# EasyEDA schematic 1-Schematic_Robot_Dog_ESP32_Control_PCB[1].json
TITLE: Sheet_1; REV: 1.0; Date: 2026-08-09; Sheet: 1/1; Drawn By: reemmelfi0; Company: Your Company
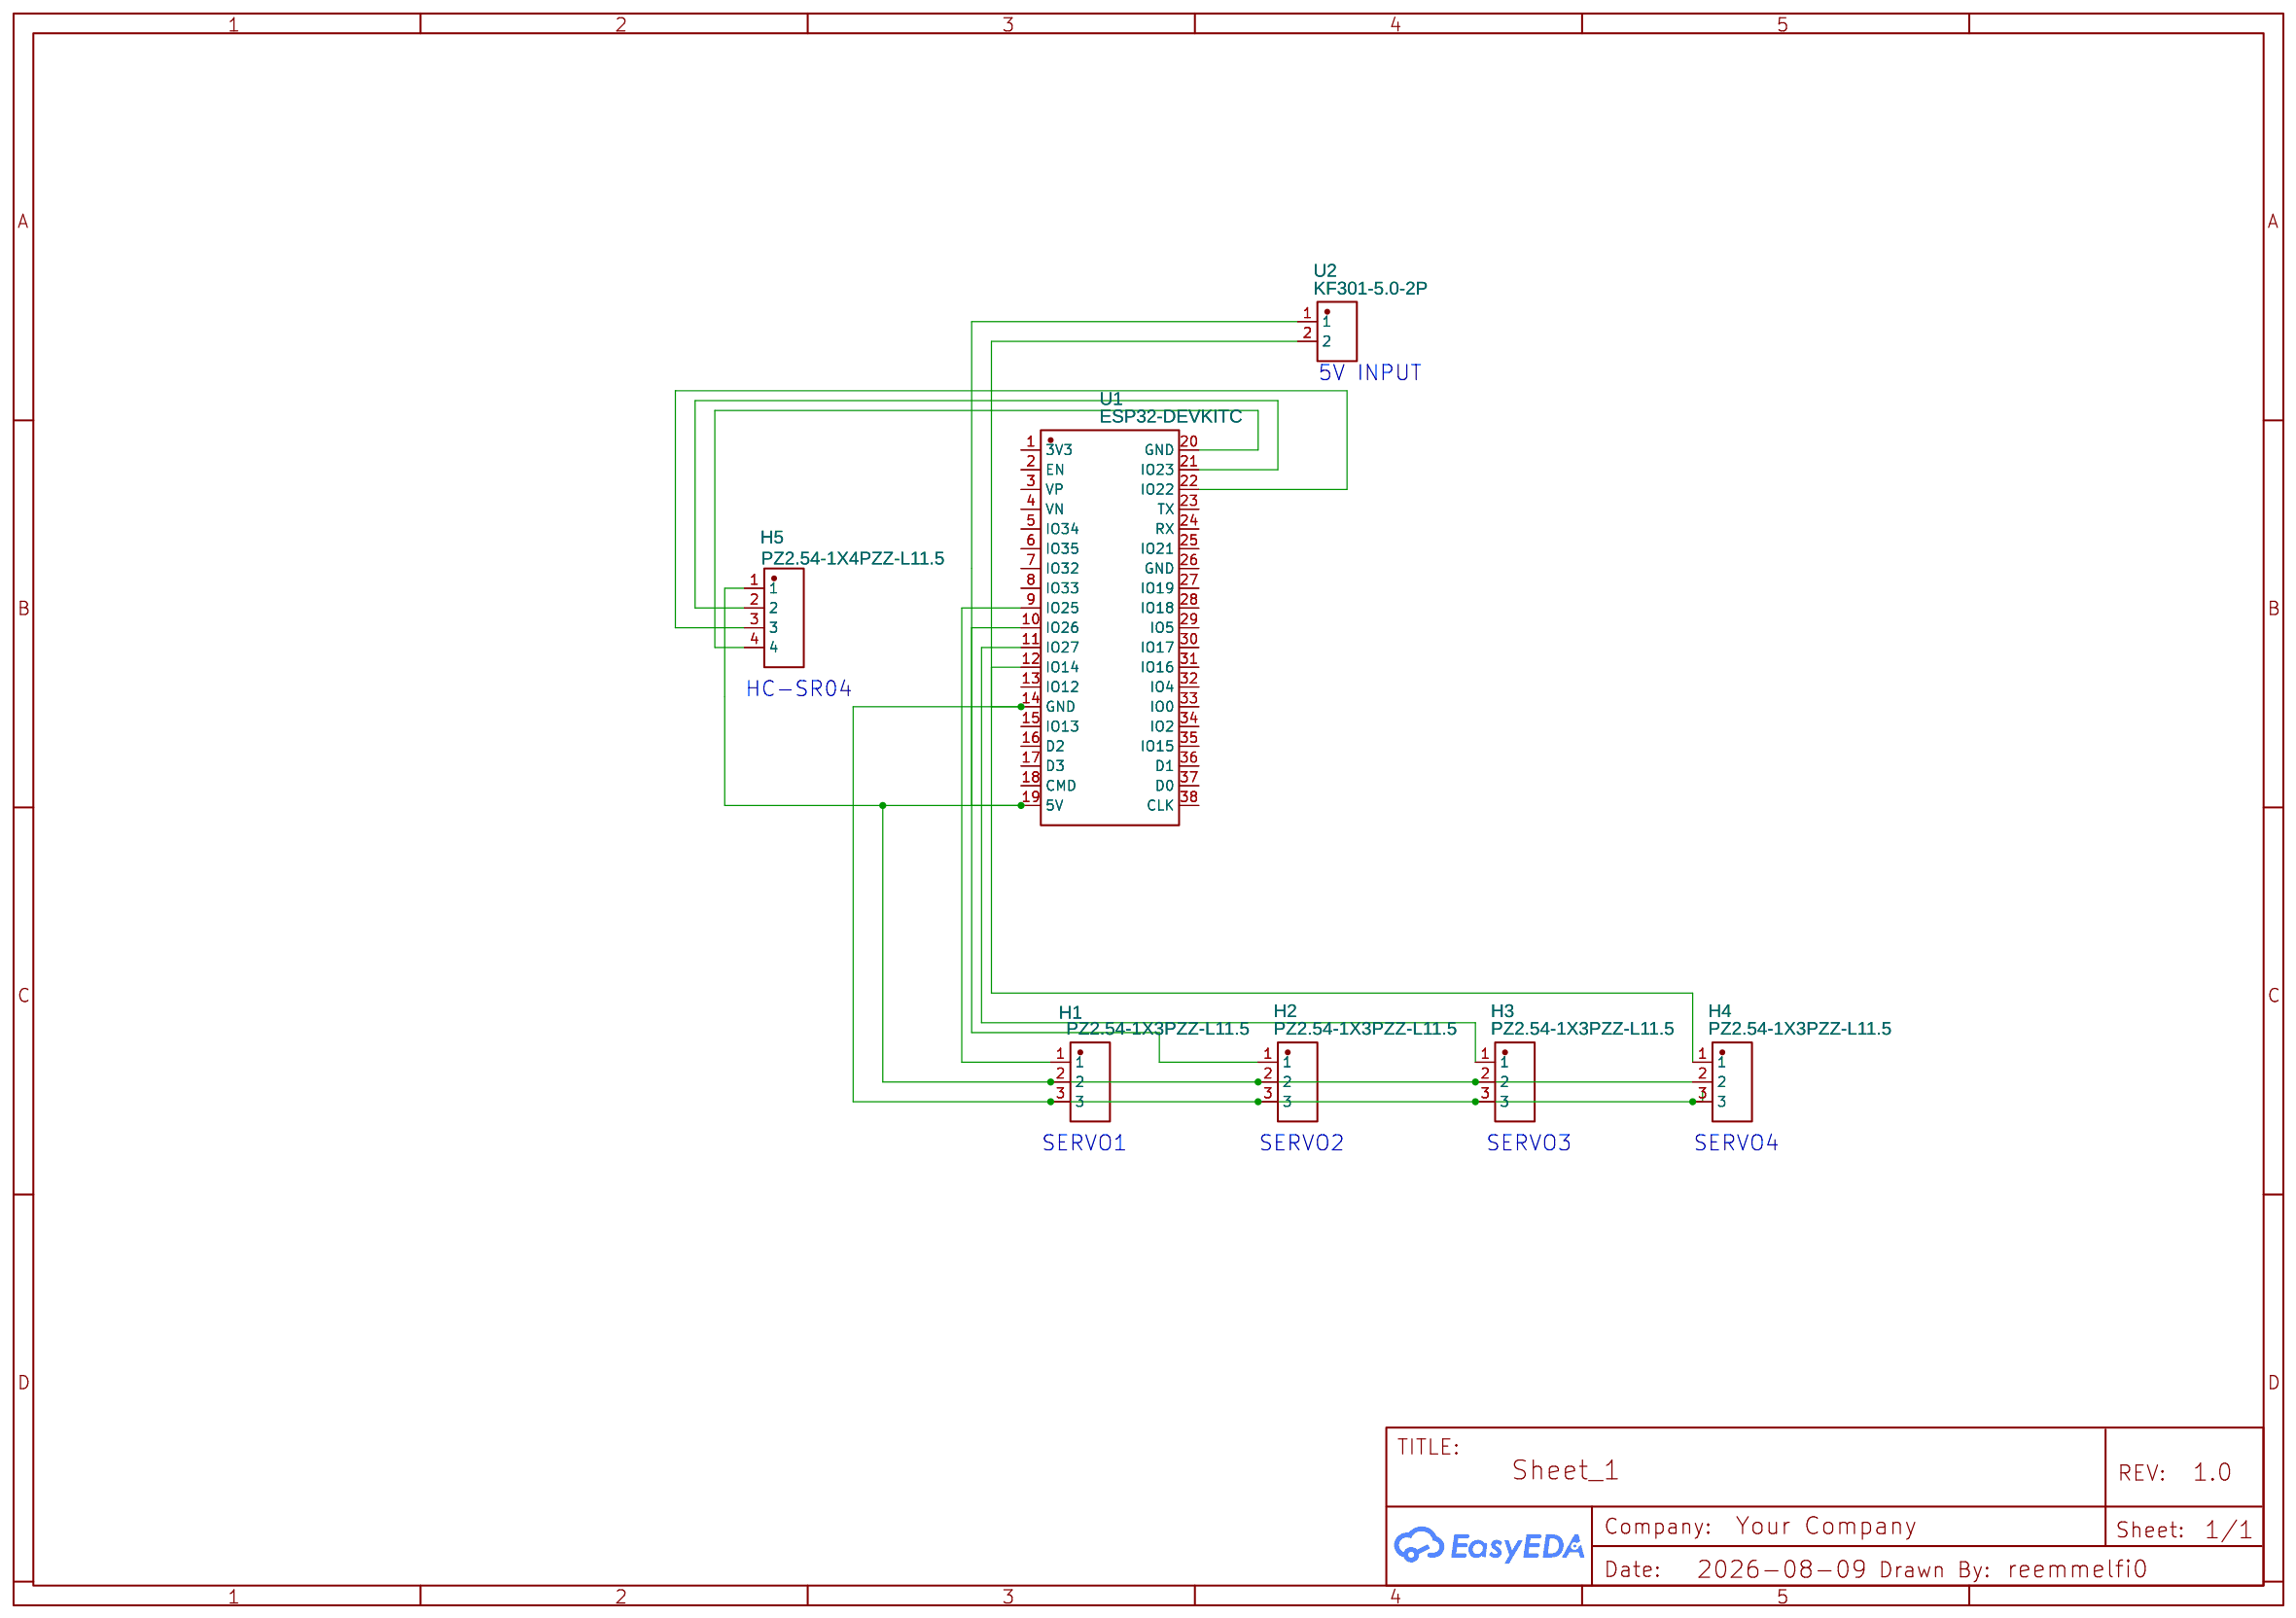
[diagram p0: schematic sheet]

## Parts
H1  PZ2.54-1X3PZZ-L11.5  [HDR-TH_PZ2.54-1X3PZZ-L11.5]
H2  PZ2.54-1X3PZZ-L11.5  [HDR-TH_PZ2.54-1X3PZZ-L11.5]
H3  PZ2.54-1X3PZZ-L11.5  [HDR-TH_PZ2.54-1X3PZZ-L11.5]
H4  PZ2.54-1X3PZZ-L11.5  [HDR-TH_PZ2.54-1X3PZZ-L11.5]
H5  PZ2.54-1X4PZZ-L11.5  [HDR-TH_PZ2.54-1X4PZZ-L11.5]
U1  ESP32-DEVKITC  [BULETM-SMD_ESP32-DEVKITC]
U2  KF301-5.0-2P  [CONN-TH_P5.00_KF301-5.0-2P]

## Library data of the parts
H1-H4 = PZ2.54-1X3PZZ-L11.5: Supplier: LCSC; Supplier Part: C54876668; Manufacturer: SHOU HAN(首韩); Manufacturer Part: PZ2.54-1x3PZZ-L11.5; Contributor: lcsc; JLCPCB Part Class: Extended Part
H5 = PZ2.54-1X4PZZ-L11.5: Supplier: LCSC; Supplier Part: C54876669; Manufacturer: SHOU HAN(首韩); Manufacturer Part: PZ2.54-1x4PZZ-L11.5; Contributor: lcsc; JLCPCB Part Class: Extended Part
U1 = ESP32-DEVKITC: Supplier: LCSC; Supplier Part: C571180; Manufacturer: ESPRESSIF(乐鑫); Manufacturer Part: ESP32-DevKitC; Contributor: lcsc
U2 = KF301-5.0-2P: Contributor: LCSC; Supplier: LCSC; Supplier Part: C474881; Manufacturer: KEFA(科发); JLCPCB Part Class: Extended Part

## Nets
Net-(H1-1): H1.1 U1.9(IO25)
Net-(H1-2): H1.2 H2.2 H3.2 H4.2 H5.1 U1.19(5V) U2.1
Net-(H1-3): H1.3 H2.3 H3.3 H4.3 U1.14(GND) U2.2
Net-(H2-1): H2.1 U1.10(IO26)
Net-(H3-1): H3.1 U1.11(IO27)
Net-(H4-1): H4.1 U1.12(IO14)
Net-(H5-2): H5.2 U1.21(IO23)
Net-(H5-3): H5.3 U1.22(IO22)
Net-(H5-4): H5.4 U1.20(GND)

Not connected (* = marked no-connect by the designer): U1 1(3V3) 2(EN) 3(VP) 4(VN) 5(IO34) 6(IO35) 7(IO32) 8(IO33) 13(IO12) 15(IO13) 16(D2) 17(D3) 18(CMD) 23(TX) 24(RX) 25(IO21) 26(GND) 27(IO19) 28(IO18) 29(IO5) 30(IO17) 31(IO16) 32(IO4) 33(IO0) 34(IO2) 35(IO15) 36(D1) 37(D0) 38(CLK)

## Notes on the sheet
- 5V INPUT
- HC-SR04
- SERVO1
- SERVO2
- SERVO3
- SERVO4
